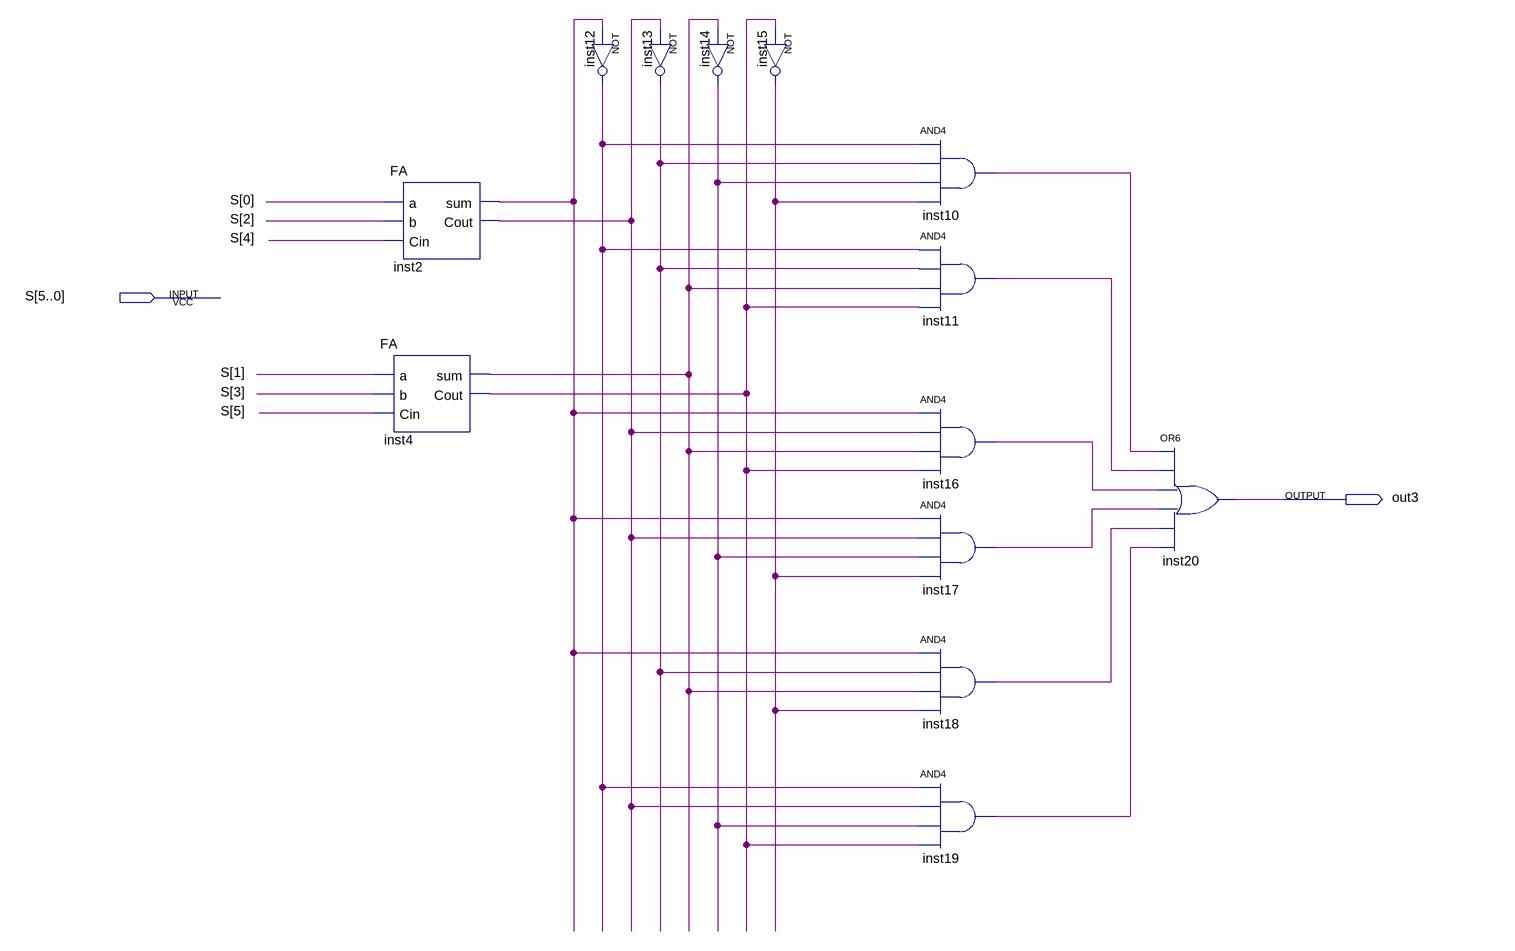
[diagram p0: schematic sheet]
// Quartus schematic division3check.bdf as structural Verilog: 13 symbols, 2 pins
module division3check (
  input  [5:0] S,
  output out3
);

  wire inst2_cout, inst2_sum, inst4_cout, inst4_sum, inst10_out, inst11_out, inst12_out, inst13_out,
       inst14_out, inst15_out, inst16_out, inst17_out, inst18_out, inst19_out;

  FA inst2 (.a(S[0]), .b(S[2]), .Cin(S[4]), .sum(inst2_sum), .Cout(inst2_cout));
  FA inst4 (.a(S[1]), .b(S[3]), .Cin(S[5]), .sum(inst4_sum), .Cout(inst4_cout));
  not inst12 (inst12_out, inst2_sum);
  not inst13 (inst13_out, inst2_cout);
  not inst14 (inst14_out, inst4_sum);
  not inst15 (inst15_out, inst4_cout);
  and inst10 (inst10_out, inst12_out, inst13_out, inst14_out, inst15_out);
  and inst11 (inst11_out, inst12_out, inst13_out, inst4_sum, inst4_cout);
  and inst16 (inst16_out, inst2_sum, inst2_cout, inst4_sum, inst4_cout);
  and inst17 (inst17_out, inst2_sum, inst2_cout, inst14_out, inst15_out);
  and inst18 (inst18_out, inst2_sum, inst13_out, inst4_sum, inst15_out);
  and inst19 (inst19_out, inst12_out, inst2_cout, inst14_out, inst4_cout);
  or inst20 (out3, inst10_out, inst11_out, inst16_out, inst17_out, inst18_out, inst19_out);
endmodule
